# EAGLE design sensing_lab_shield_1-5-1 (EAGLE 6.4)
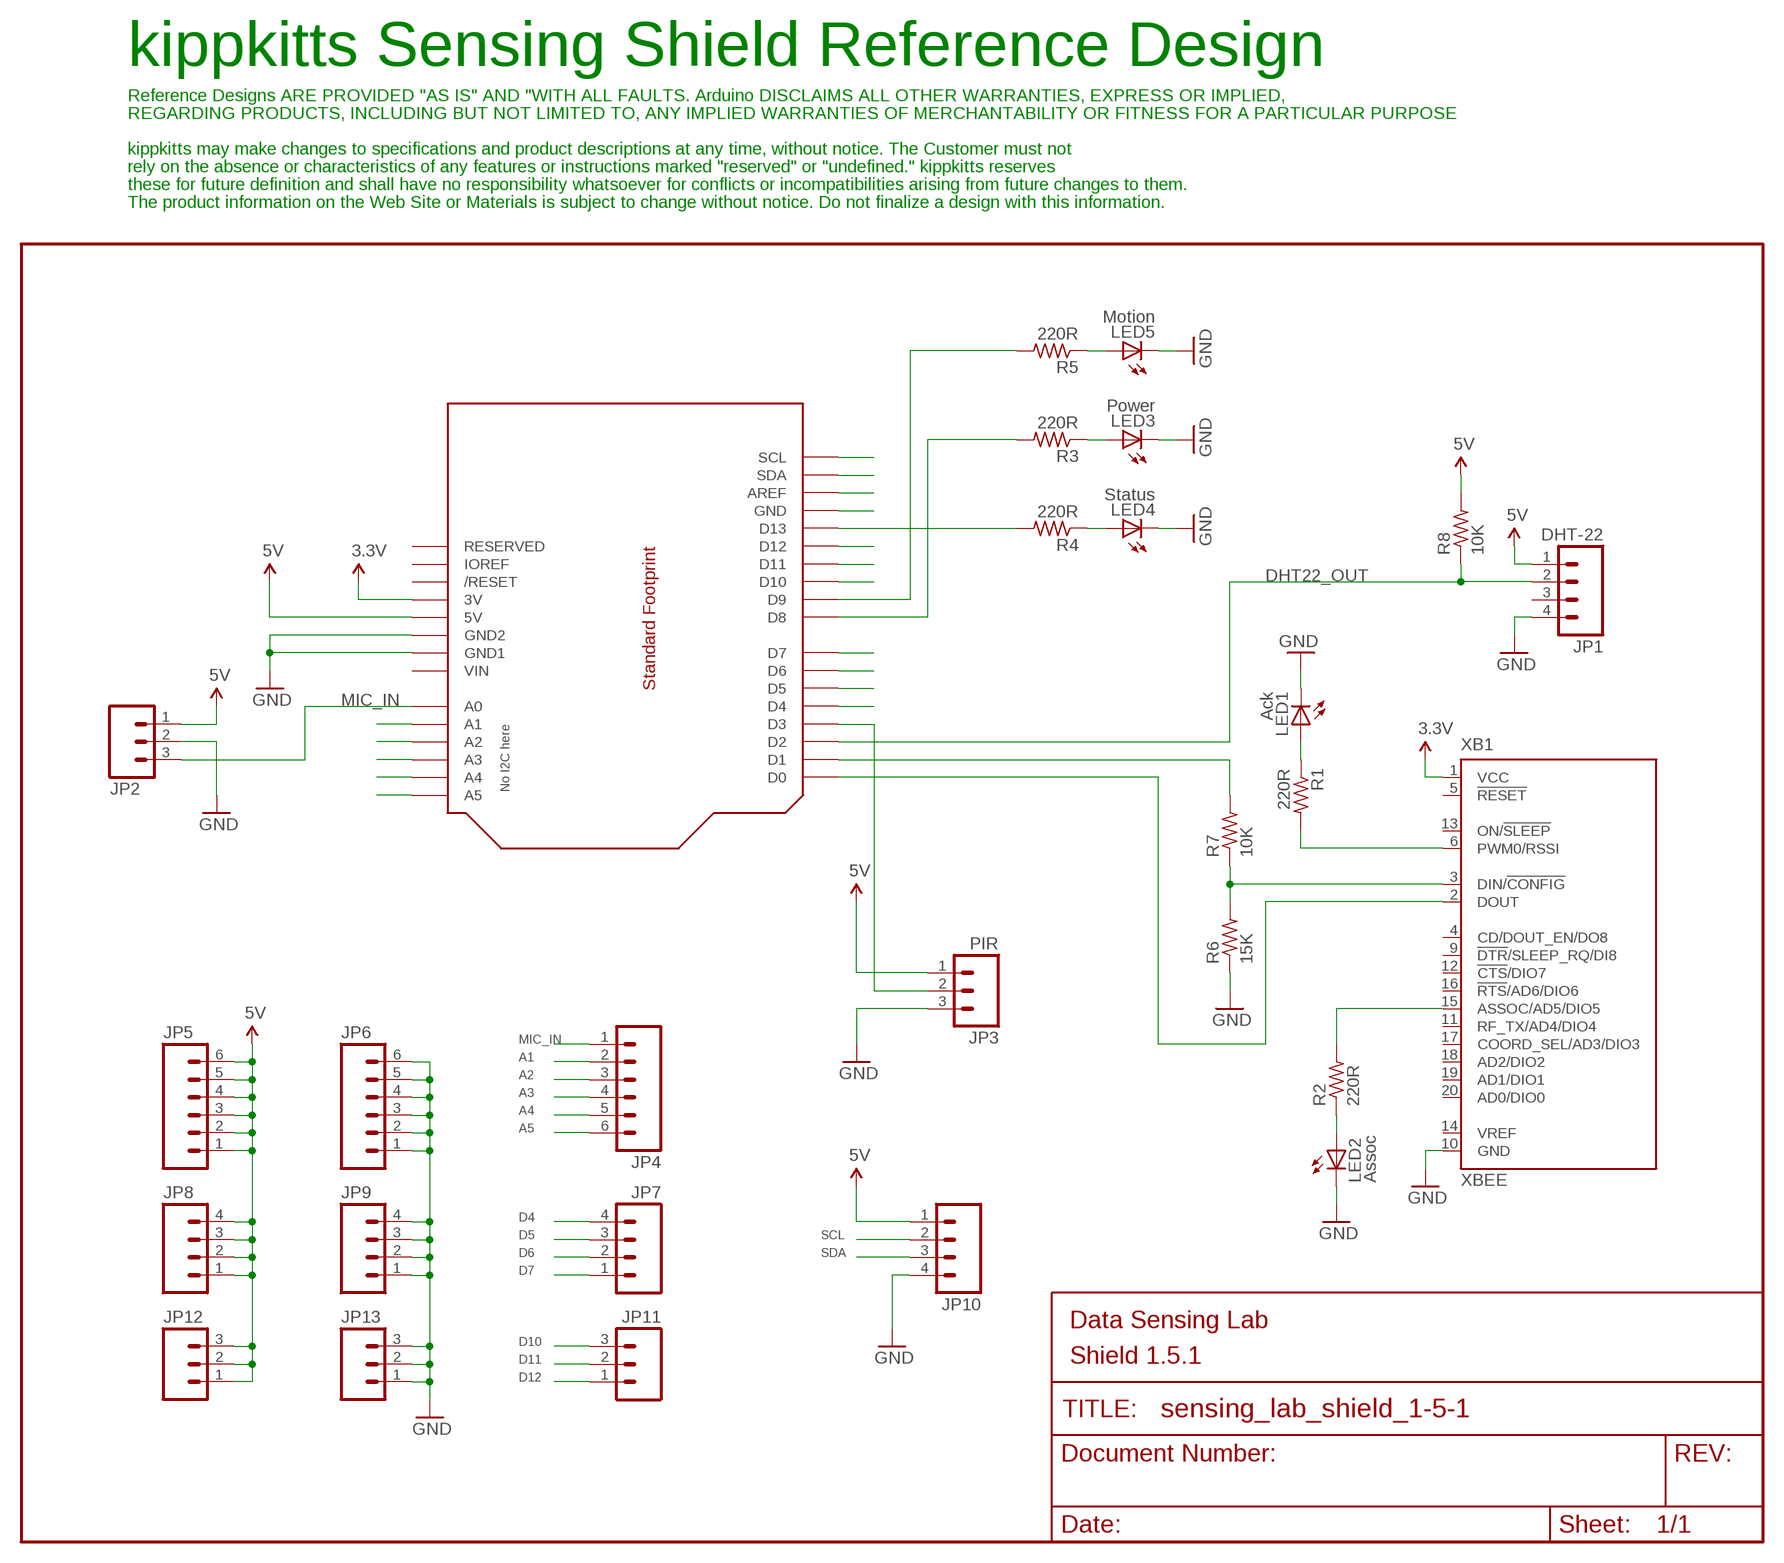
[diagram p0: schematic, sheet 1]

## Parts
JP1  DHT-22  M04PTH  [1X04]
JP2  M03POLAR_LOCK  [MOLEX-1X3_LOCK]
JP3  PIR  M03SCREW_LOCK  [SCREWTERMINAL-3.5MM-3_LOCK.007S]
JP4  M06SIP  [1X06]
JP5  M06SIP  [1X06]
JP6  M06SIP  [1X06]
JP7  M04PTH  [1X04]
JP8  M04PTH  [1X04]
JP9  M04PTH  [1X04]
JP10  M04PTH  [1X04]
JP11  M03PTH  [1X03]
JP12  M03PTH  [1X03]
JP13  M03PTH  [1X03]
LED1  Ack  LED3MM  [LED3MM]
LED2  Assoc  LED3MM  [LED3MM]
LED3  Power  LED3MM  [LED3MM]
LED4  Status  LED3MM  [LED3MM]
LED5  Motion  LED3MM  [LED3MM]
R1  220R  R-US_0207/10  [0207/10]
R2  220R  R-US_0207/10  [0207/10]
R3  220R  R-US_0207/10  [0207/10]
R4  220R  R-US_0207/10  [0207/10]
R5  220R  R-US_0207/10  [0207/10]
R6  15K  R-US_0207/10  [0207/10]
R7  10K  R-US_0207/10  [0207/10]
R8  10K  R-US_0207/10  [0207/10]
U1  ARDUINOR3-DIMENSION  [ARDUINOR3]
XB1  XBEE  [XBEE]

## Nets
3.3V: U1.3V XB1.1(VCC)
3V3_ARD_TX: R6.2 R7.1 XB1.3(DIN/!CONFIG)
5V: JP1.1 JP2.1 JP3.1 JP5.1 JP5.2 JP5.3 JP5.4 JP5.5 JP5.6 JP8.1 JP8.2 JP8.3 JP8.4 JP10.1 JP12.1 JP12.2 JP12.3 R8.2 U1.5V
A1: JP4.2 U1.A1
A2: JP4.3 U1.A2
A3: JP4.4 U1.A3
A4: JP4.5 U1.A4
A5: JP4.6 U1.A5
ARD_RX: U1.D0 XB1.2(DOUT)
ARD_TX: R7.2 U1.D1
D4: JP7.4 U1.D4
D5: JP7.3 U1.D5
D6: JP7.2 U1.D6
D7: JP7.1 U1.D7
D10: JP11.3 U1.D10
D11: JP11.2 U1.D11
D12: JP11.1 U1.D12
DHT22_OUT: JP1.2 R8.1 U1.D2
GND: JP1.4 JP2.2 JP3.3 JP6.1 JP6.2 JP6.3 JP6.4 JP6.5 JP6.6 JP9.1 JP9.2 JP9.3 JP9.4 JP10.4 JP13.1 JP13.2 JP13.3 LED1.K(C) LED2.K(C) LED3.K(C) LED4.K(C) LED5.K(C) R6.1 U1.GND1 U1.GND2 XB1.10(GND)
MIC_IN: JP2.3 JP4.1 U1.A0
N$1: LED1.A R1.1
N$2: LED2.A R2.1
N$3: R1.2 XB1.6(PWM0/RSSI)
N$4: R2.2 XB1.15(ASSOC/AD5/DIO5)
N$5: LED3.A R3.1
N$6: R5.2 U1.D9
N$7: LED5.A R5.1
N$8: R3.2 U1.D8
N$9: LED4.A R4.1
N$10: R4.2 U1.D13
N$11: JP3.2 U1.D3
N$29: U1.AREF
N$30: U1.GND
SCL: JP10.2 U1.SCL
SDA: JP10.3 U1.SDA
Unconnected: JP1.3 U1.IOREF U1.RESERVED U1.RESET(/RESET) XB1.4(CD/DOUT_EN/DO8) XB1.5(!RESET) XB1.9(!DTR!/SLEEP_RQ/DI8) XB1.11(RF_TX/AD4/DIO4) XB1.12(!CTS!/DIO7) XB1.13(ON/!SLEEP) XB1.14(VREF) XB1.16(!RTS!/AD6/DIO6) XB1.17(COORD_SEL/AD3/DIO3) XB1.18(AD2/DIO2) XB1.19(AD1/DIO1) XB1.20(AD0/DIO0)

## Notes on the sheet
- kippkitts Sensing Shield Reference Design
- Reference Designs ARE PROVIDED "AS IS" AND "WITH ALL FAULTS. Arduino DISCLAIMS ALL OTHER WARRANTIES, EXPRESS OR IMPLIED,
- REGARDING PRODUCTS, INCLUDING BUT NOT LIMITED TO, ANY IMPLIED WARRANTIES OF MERCHANTABILITY OR FITNESS FOR A PARTICULAR PURPOSE
- kippkitts may make changes to specifications and product descriptions at any time, without notice. The Customer must not
- rely on the absence or characteristics of any features or instructions marked "reserved" or "undefined." kippkitts reserves
- these for future definition and shall have no responsibility whatsoever for conflicts or incompatibilities arising from future changes to them.
- The product information on the Web Site or Materials is subject to change without notice. Do not finalize a design with this information.
- Data Sensing Lab
- Shield 1.5.1

## Power pins joined to a net without a drawn wire
VIN: U1.VIN

## Library data of the parts
JP1 JP7-JP10 = SparkFun:M04: Header 4 Standard 4-pin 0.1" header. Use with straight break away headers (SKU : PRT-00116), right angle break away headers (PRT-00553), swiss pins (PRT-00743), machine pins (PRT-00117), and female headers (PRT-00115). Molex polarized connector foot print use with SKU : PRT-08231 with associated crimp pins and housings.
JP2 JP3 JP11-JP13 = SparkFun:M03: Header 3 Standard 3-pin 0.1" header. Use with straight break away headers (SKU : PRT-00116), right angle break away headers (PRT-00553), swiss pins (PRT-00743), machine pins (PRT-00117), and female headers (PRT-00115). Molex polarized connector foot print use with SKU : PRT-08232 with associated crimp pins and housings.
JP4-JP6 = SparkFun:M06: Header 6 Standard 6-pin 0.1" header. Use with straight break away headers (SKU : PRT-00116), right angle break away headers (PRT-00553), swiss pins (PRT-00743), machine pins (PRT-00117), and female headers (PRT-00115). Molex polarized connector foot print use with SKU : PRT-08094 with associated crimp pins and housings. NOTES ON THE VARIANTS LOCK and LOCK_LONGPADS... This footprint was designed to help hold the alignment of a through-hole component (i.e. 6-pin header) while soldering it into place. You may notice that each hole has been shifted either up or down by 0.005 of an inch from it's more standard position (which is a perfectly straight line). This slight alteration caused the pins (the squares in the middle) to touch the edges of the holes. Because they are alternating, it causes a "brace" to hold the component in place. 0.005 has proven to be the perfect amount of "off-center" position when using our standard breakaway headers. Although looks a little odd when you look at the bare footprint, once you have a header in there, the alteration is very hard to notice. Also, if you push a header all the way into place, it is covered up entirely on the bottom side. This idea of altering the position of holes to aid alignment will be further integrated into the Sparkfun Library for other footprints. It can help hold any component with 3 or more connection pins.
LED1-LED5 = SparkFun:LED: LEDs Standard schematic elements and footprints for 5mm, 3mm, 1206, and 0603 sized LEDs. 5mm - Spark Fun Electronics SKU : COM-00529 (and others)
R1-R8 = adafruit:R-US_: RESISTOR, American symbol
U1 = KippKitts:ARDUINOR3: This is a new object for the new Arduino R3 - with extra pins that you may want to use (such as IOref, and duplicated A4/A5
XB1 = maxstream:XBEE: XBee (TM) /XBee-PRO(TM) OEM RF Modules Source: MaxStream, Inc. xbee_productmanual.pdf; MPN: XBP24-Z7UIT-004; OC_FARNELL: 1751799; OC_NEWARK: 34R5507

## Board
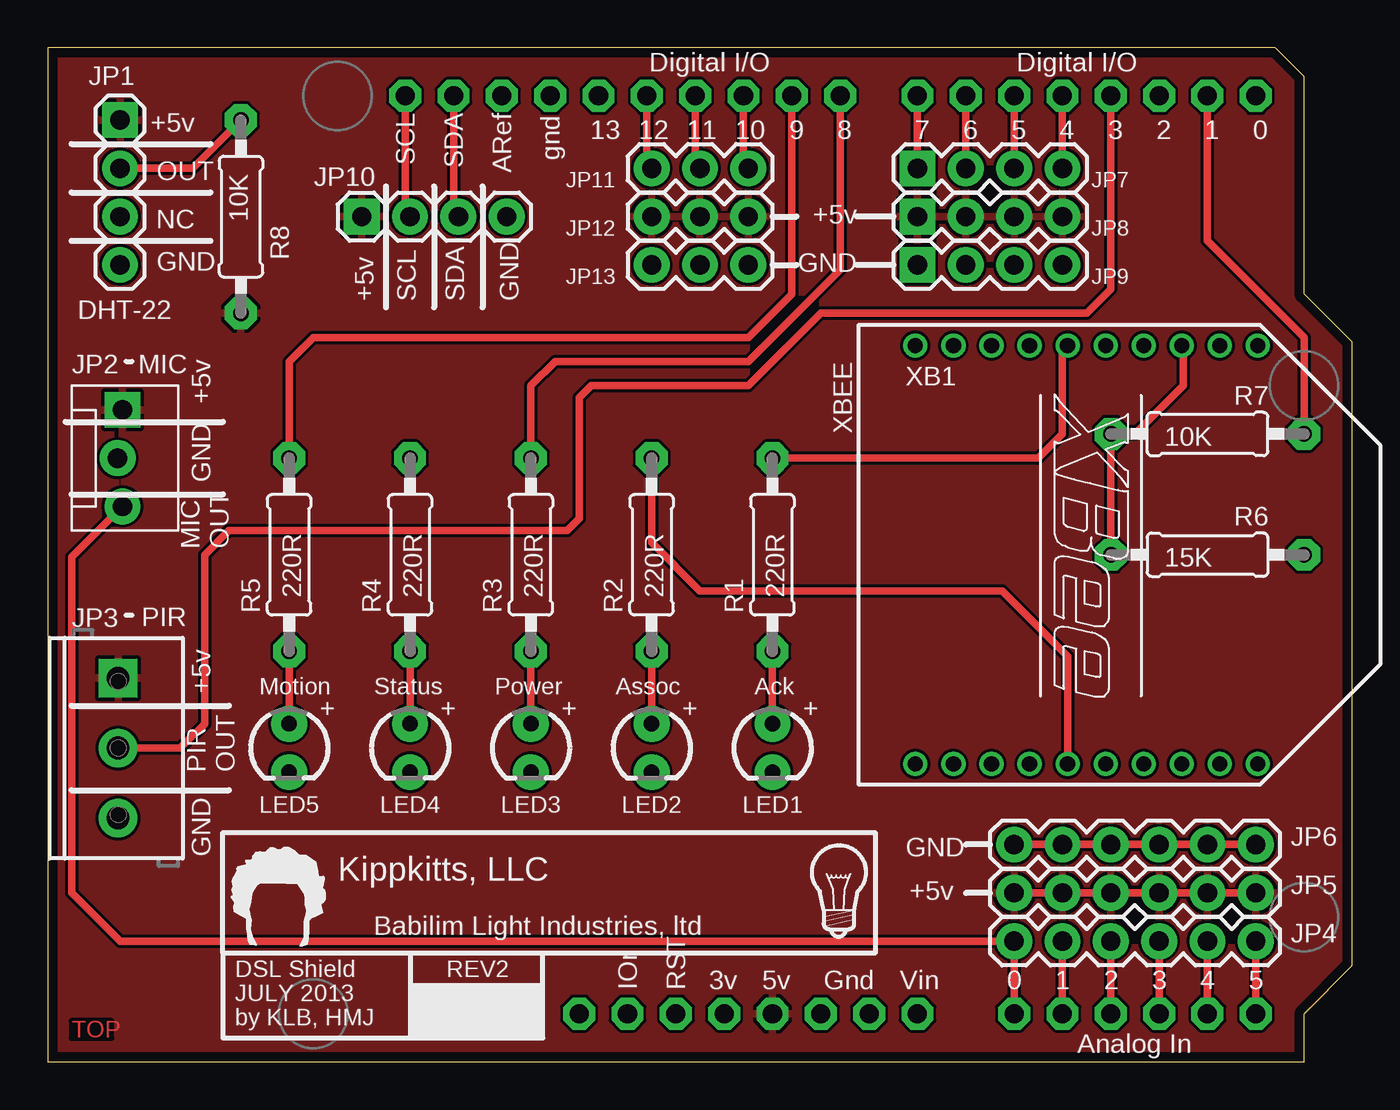
[diagram p1: board, top side]
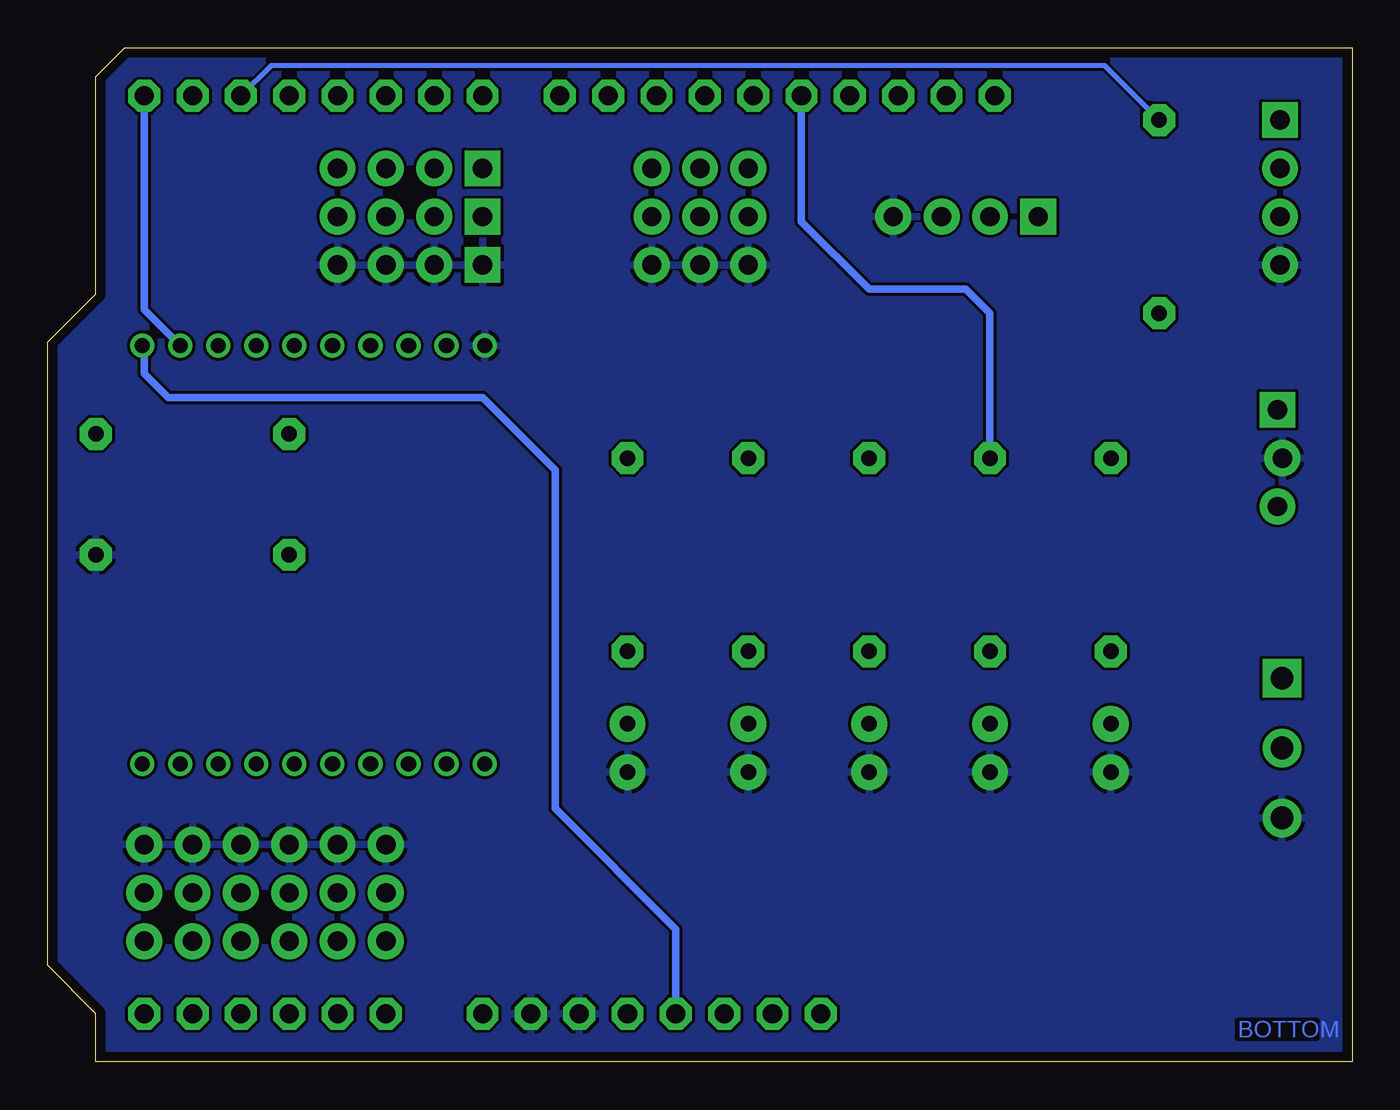
[diagram p2: board, bottom side, seen from below]

Size 68.58 x 53.34 mm. Coordinates in mm from the lower left corner, seen from the top.
Copper layers (1*16): Top 0.035mm / dielectric 1.5mm / Bottom 0.035mm
Design rules "PCB-pool": minimum track width 6mil, minimum drill 12mil, track to track 6mil, track to pad 6mil, pad to pad 6mil, via to via 6mil, smd to smd 6mil, copper to edge 20mil, drill to drill 8mil, minimum pad ring 8mil, minimum via ring 6mil, stop-mask expansion 3mil, vias tented up to drill 0mil, thermal gap 8mil

### Footprints (pad centres in the part's own frame; a part is rotated, then mirrored left to right if it is on the bottom)
1X04 = drill 1.016 pad 1.88 square: 1 0,0 | drill 1.016 pad 1.88: 2 2.54,0; 3 5.08,0; 4 7.62,0
MOLEX-1X3_LOCK = drill 1.016 pad 1.88 square: 1 0,0.127 | drill 1.016 pad 1.88: 2 2.54,-0.127; 3 5.08,0.127
SCREWTERMINAL-3.5MM-3_LOCK.007S = drill 1.2 pad 2.032 square: 1 -0.178,0 | drill 1.2 pad 2.032: 2 3.5,0; 3 7.178,0
1X06 = drill 1.016 pad 1.88: 1 0,0; 2 2.54,0; 3 5.08,0; 4 7.62,0; 5 10.16,0; 6 12.7,0
1X03 = drill 1.016 pad 1.88: 1 0,0; 2 2.54,0; 3 5.08,0
LED3MM = drill 0.813 pad 1.88: A -1.27,0; K 1.27,0
0207/10 = drill 0.813 pad 1.676 octagon: 1 -5.08,0; 2 5.08,0
ARDUINOR3 = drill 1 pad 1.676 octagon: 3V 35.56,2.54; 5V 38.1,2.54; A0 50.8,2.54; A1 53.34,2.54; A2 55.88,2.54; A3 58.42,2.54; A4 60.96,2.54; A5 63.5,2.54; AREF 23.876,50.8; D0 63.5,50.8; D1 60.96,50.8; D2 58.42,50.8; D3 55.88,50.8; D4 53.34,50.8; D5 50.8,50.8; D6 48.26,50.8; D7 45.72,50.8; D8 41.656,50.8; D9 39.116,50.8; D10 36.576,50.8; D11 34.036,50.8; D12 31.496,50.8; D13 28.956,50.8; GND 26.416,50.8; GND1 43.18,2.54; GND2 40.64,2.54; IOREF 30.48,2.54; RESERVED 27.94,2.54; RESET 33.02,2.54; SCL 18.796,50.8; SDA 21.336,50.8; VIN 45.72,2.54
XBEE = drill 0.8 pad 1.27: 1 -11,9; 2 -11,7; 3 -11,5; 4 -11,3; 5 -11,1; 6 -11,-1; 7 -11,-3; 8 -11,-5; 9 -11,-7; 10 -11,-9; 11 11,-9; 12 11,-7; 13 11,-5; 14 11,-3; 15 11,-1; 16 11,1; 17 11,3; 18 11,5; 19 11,7; 20 11,9

### Placement (x,y rotation side)
JP1  3.81,49.53 270 top
JP2  3.81,34.29 270 top
JP3  3.7,20.01 270 top
JP4  50.8,6.35 0 top
JP5  50.8,8.89 0 top
JP6  50.8,11.43 0 top
JP7  45.72,46.99 0 top
JP8  45.72,44.45 0 top
JP9  45.72,41.91 0 top
JP10  16.51,44.45 0 top
JP11  31.75,46.99 0 top
JP12  31.75,44.45 0 top
JP13  31.75,41.91 0 top
LED1  38.1,16.51 270 top
LED2  31.75,16.51 270 top
LED3  25.4,16.51 270 top
LED4  19.05,16.51 270 top
LED5  12.7,16.51 270 top
R1  38.1,26.67 90 top
R2  31.75,26.67 90 top
R3  25.4,26.67 90 top
R4  19.05,26.67 90 top
R5  12.7,26.67 90 top
R6  60.96,26.67 180 top
R7  60.96,33.02 0 top
R8  10.16,44.45 270 top
U1  0,0 0 top
U$6  [BABILIM_7.5MM]  41.59,6.99 0 top
U$7  [TOP_DOCU_5MM]  8.89,5.4 0 top
XB1  54.61,26.67 270 top

### Tracks (layer width: path | path; a pad name or v marks a point on that pad's centre or on a via)
3.3V
  Bottom 0.406: U1.3V 35.56,6.99 41.91,13.34 41.91,31.11 45.72,34.92 62.23,34.92 63.5,36.2 63.5,37.56 XB1.1
3V3_ARD_TX
  Top 0.406: XB1.3 59.69,37.59 59.69,35.56 57.15,33.02 R7.1 R6.2
5V
  Top 0.406: JP5.6 JP5.1
  pour Top: -0.64,53.98 69.22,53.98 69.22,-0.64 -0.64,-0.64
A1
  Top 0.406: JP4.2 U1.A1
A2
  Top 0.406: JP4.3 U1.A2
A3
  Top 0.406: JP4.4 U1.A3
A4
  Top 0.406: JP4.5 U1.A4
A5
  Top 0.406: JP4.6 U1.A5
ARD_RX
  Bottom 0.406: U1.D0 63.5,39.56 XB1.2
ARD_TX
  Top 0.406: U1.D1 60.96,43.18 66.04,38.1 R7.2
D4
  Top 0.406: U1.D4 JP7.4
D5
  Top 0.406: U1.D5 JP7.3
D6
  Top 0.406: U1.D6 JP7.2
D7
  Top 0.406: U1.D7 JP7.1
D10
  Top 0.406: U1.D10 36.58,47.24 JP11.3
D11
  Top 0.406: U1.D11 34.04,47.24 JP11.2
D12
  Top 0.406: U1.D12 31.5,47.24 JP11.1
DHT22_OUT
  Top 0.406: JP1.2 7.62,46.99 R8.1
  Bottom 0.254: R8.1 13.02,52.39 56.83,52.39 U1.D2
GND
  Top 0.406: JP6.6 JP6.1
  pour Bottom: -1.91,54.61 71.75,54.61 71.75,-2.54 -1.91,-2.54
MIC_IN
  Top 0.406: U1.A0 JP4.1 3.81,6.35 1.27,8.89 1.27,26.54 JP2.3
N$1
  Top 0.406: R1.1 LED1.A
N$2
  Top 0.406: R2.1 LED2.A
N$3
  Top 0.406: R1.2 52.07,31.75 53.34,33.02 53.34,37.4 XB1.6
N$4
  Top 0.406: XB1.15 53.61,21.32 50.16,24.77 34.29,24.77 31.75,27.3 R2.2
N$5
  Top 0.406: R3.1 LED3.A
N$6
  Top 0.406: U1.D9 39.12,40.39 36.83,38.1 13.97,38.1 12.7,36.83 R5.2
N$7
  Top 0.406: R5.1 LED5.A
N$8
  Top 0.406: U1.D8 41.66,41.66 36.83,36.83 26.67,36.83 25.4,35.56 R3.2
N$9
  Top 0.406: R4.1 LED4.A
N$10
  Bottom 0.406: U1.D13 28.96,44.2 25.4,40.64 20.32,40.64 19.05,39.37 R4.2
N$11
  Top 0.406: U1.D3 55.88,40.64 54.61,39.37 40.64,39.37 36.83,35.56 28.57,35.56 27.94,34.92 27.94,28.57 27.3,27.94 9.53,27.94 8.26,26.67 8.26,17.78 6.99,16.51 JP3.2
SCL
  Top 0.406: U1.SCL 18.8,44.7 JP10.2
SDA
  Top 0.406: U1.SDA 21.34,44.7 JP10.3

### Text on the board
Top: TOP
Bottom: BOTTOM
tPlace: Kippkitts, LLC | Babilim Light Industries, ltd
tNames: +5v | OUT | +5v | NC | GND | GND | +5v | SCL | SDA | GND | JP2 | MIC | +5v | GND | MIC / OUT | +5v | + | + | + | + | + | PIR / OUT | GND | GND | +5v | DSL Shield | REV2 | JULY 2013 | by KLB, HMJ